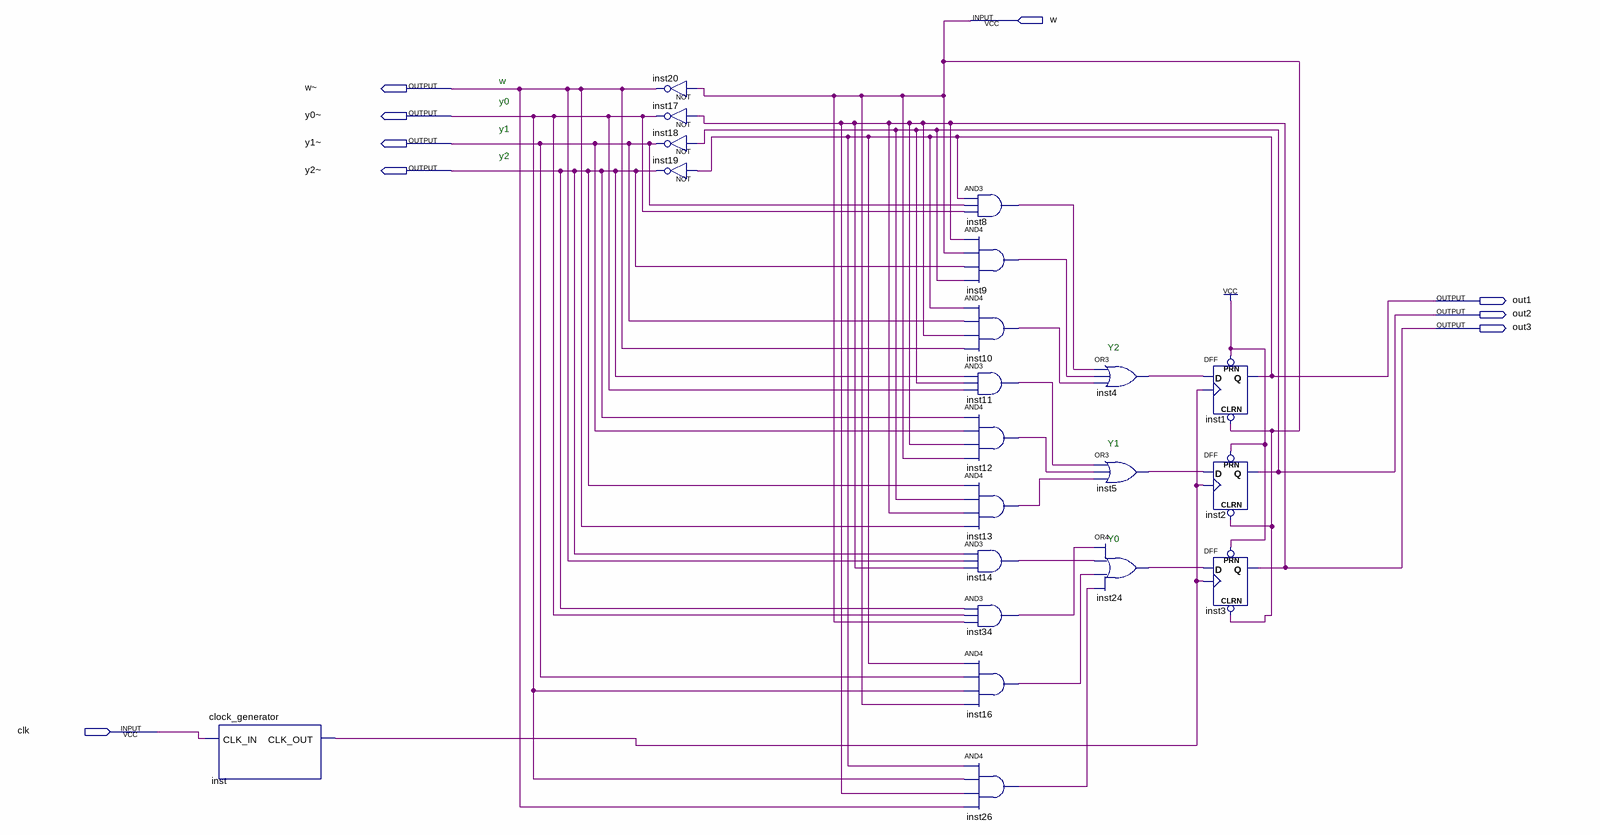
[diagram p0: schematic sheet]
// Quartus schematic nineCounter.bdf as structural Verilog: 21 symbols, 9 pins
module nineCounter (
  input  w,
  input  clk,
  output \w~ ,
  output \y0~ ,
  output \y1~ ,
  output \y2~ ,
  output out1,
  output out2,
  output out3
);

  wire inst4_out, inst5_out, inst8_out, inst9_out, inst10_out, inst11_out, inst12_out, inst13_out,
       inst14_out, inst16_out, inst24_out, inst26_out, inst34_out, inst_clk_out;

  clock_generator inst (.CLK_IN(clk), .CLK_OUT(inst_clk_out));
  not inst20 (\w~ , w);
  not inst17 (\y0~ , out3);
  not inst18 (\y1~ , out2);
  not inst19 (\y2~ , out1);
  and inst8 (inst8_out, out1, \y1~ , \y0~ );
  and inst9 (inst9_out, out3, w, \y2~ , out2);
  and inst10 (inst10_out, out1, \y1~ , out3, \w~ );
  and inst11 (inst11_out, \y2~ , out2, \y0~ );
  and inst12 (inst12_out, \y2~ , \y1~ , out3, w);
  and inst13 (inst13_out, \y2~ , out2, out3, \w~ );
  and inst14 (inst14_out, \y2~ , \w~ , out3);
  and inst34 (inst34_out, \y2~ , \y0~ , w);
  and inst16 (inst16_out, out1, \y1~ , \y0~ , w);
  and inst26 (inst26_out, out1, \y0~ , out3, \w~ );
  or inst4 (inst4_out, inst8_out, inst9_out, inst10_out);
  or inst5 (inst5_out, inst11_out, inst12_out, inst13_out);
  or inst24 (inst24_out, inst34_out, inst14_out, inst16_out, inst26_out);
  DFF inst1 (.CLRN(w), .CLK(inst_clk_out), .D(inst4_out), .PRN(1'b1), .Q(out1));
  DFF inst2 (.CLRN(w), .CLK(inst_clk_out), .D(inst5_out), .PRN(1'b1), .Q(out2));
  DFF inst3 (.CLRN(w), .CLK(inst_clk_out), .D(inst24_out), .PRN(1'b1), .Q(out3));

  // Notes on the sheet:
  //   w
  //   y0
  //   y1
  //   y2
  //   Y2
  //   Y1
  //   Y0
endmodule
